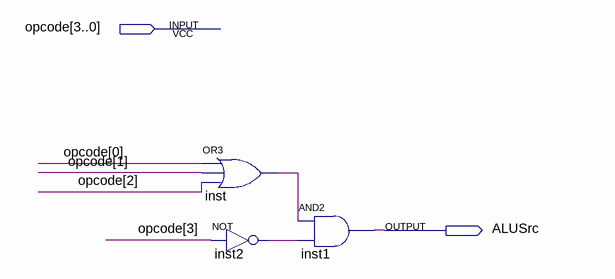
[diagram p0: schematic sheet]
// Quartus schematic ALUSrc.bdf as structural Verilog: 3 symbols, 2 pins
module ALUSrc (
  input  [3:0] opcode,
  output ALUSrc
);

  wire inst2_out, inst_out;

  or inst (inst_out, opcode[0], opcode[1], opcode[2]);
  not inst2 (inst2_out, opcode[3]);
  and inst1 (ALUSrc, inst_out, inst2_out);
endmodule
